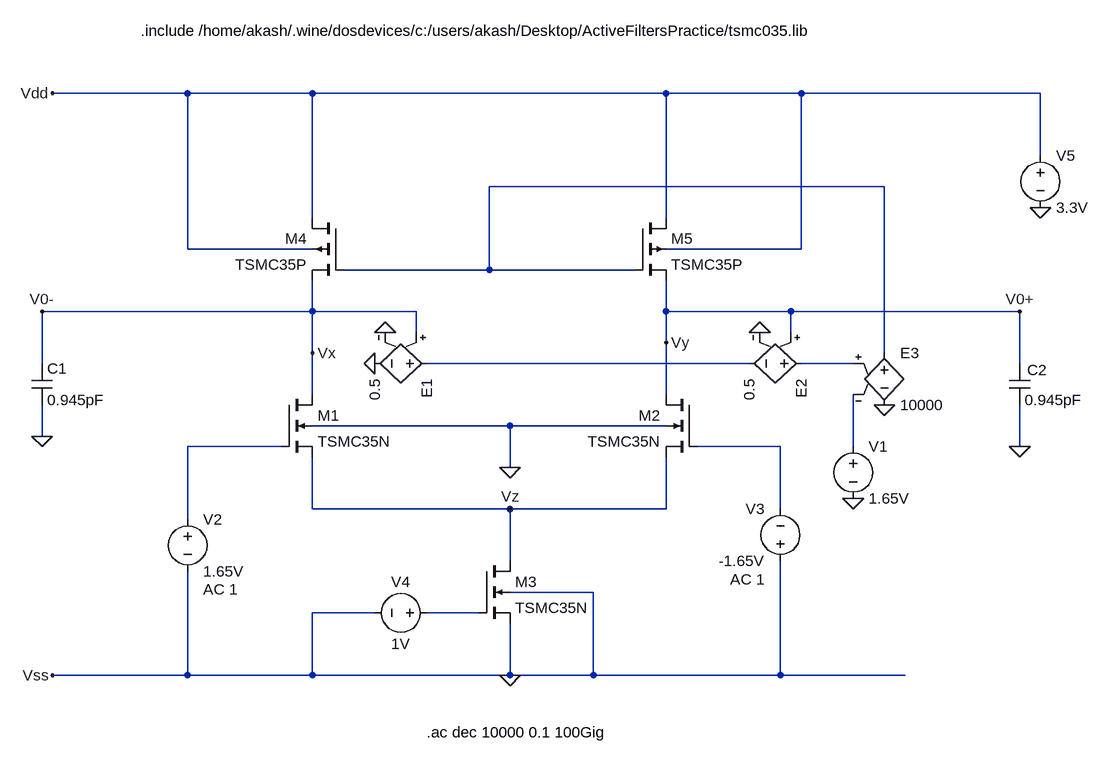
[diagram p0: schematic Transconductor_with_CMFB.asc]
Transconductor_with_CMFB.asc, the LTspice schematic file:
Version 4
SHEET 1 1440 1128
WIRE -16 112 -224 112
WIRE 176 112 -16 112
WIRE 720 112 176 112
WIRE 928 112 720 112
WIRE 1296 112 928 112
WIRE 1296 208 1296 112
WIRE 1056 256 448 256
WIRE 176 304 176 112
WIRE 720 304 720 112
WIRE -16 352 -16 112
WIRE 176 352 -16 352
WIRE 928 352 928 112
WIRE 928 352 720 352
WIRE 448 384 448 256
WIRE 448 384 224 384
WIRE 672 384 448 384
WIRE 176 448 176 400
WIRE 176 448 -240 448
WIRE 336 448 176 448
WIRE 720 448 720 400
WIRE 912 448 720 448
WIRE 1264 448 912 448
WIRE 336 480 336 448
WIRE 912 480 912 448
WIRE 720 496 720 448
WIRE 176 512 176 448
WIRE 1056 512 1056 256
WIRE -240 528 -240 448
WIRE 848 528 352 528
WIRE 1008 528 928 528
WIRE 1264 528 1264 448
WIRE 176 576 176 512
WIRE 720 576 720 496
WIRE 480 624 176 624
WIRE 720 624 480 624
WIRE -240 640 -240 592
WIRE 128 656 -16 656
WIRE 896 656 768 656
WIRE 1008 656 1008 576
WIRE 1264 656 1264 592
WIRE 480 688 480 624
WIRE 176 752 176 672
WIRE 480 752 176 752
WIRE 720 752 720 672
WIRE 720 752 480 752
WIRE 896 752 896 656
WIRE -16 768 -16 656
WIRE 480 832 480 752
WIRE 608 880 480 880
WIRE 272 912 176 912
WIRE 432 912 352 912
WIRE -16 1008 -16 848
WIRE -16 1008 -224 1008
WIRE 176 1008 176 912
WIRE 176 1008 -16 1008
WIRE 480 1008 480 928
WIRE 480 1008 176 1008
WIRE 608 1008 608 880
WIRE 608 1008 480 1008
WIRE 896 1008 896 832
WIRE 896 1008 608 1008
WIRE 1088 1008 896 1008
FLAG 480 1008 0
FLAG 480 688 0
FLAG 288 480 0
FLAG 864 480 0
FLAG 1056 592 0
FLAG 272 528 0
FLAG 1008 736 0
FLAG 1296 288 0
FLAG 176 512 Vx
FLAG 720 496 Vy
FLAG 480 752 Vz
FLAG -224 112 Vdd
FLAG -224 1008 Vss
FLAG -240 640 0
FLAG 1264 656 0
FLAG 1264 448 V0+
FLAG -240 448 V0-
SYMBOL nmos4 128 576 R0
SYMATTR InstName M1
SYMATTR Value TSMC35N
SYMATTR Value2 l=0.5u w=1.77u m=8
SYMBOL nmos4 768 576 M0
SYMATTR InstName M2
SYMATTR Value TSMC35N
SYMATTR Value2 l=0.5u w=1.77u m=8
SYMBOL nmos4 432 832 R0
SYMATTR InstName M3
SYMATTR Value TSMC35N
SYMATTR Value2 l=0.5u w=1.33u m=16
SYMBOL pmos4 224 304 M0
SYMATTR InstName M4
SYMATTR Value TSMC35P
SYMATTR Value2 l=0.5u w=1u m=8
SYMBOL pmos4 672 304 R0
SYMATTR InstName M5
SYMATTR Value TSMC35P
SYMATTR Value2 l=0.5u w=1u m=8
SYMBOL e 368 528 R90
SYMATTR InstName E1
SYMATTR Value 0.5
SYMBOL e 944 528 R90
SYMATTR InstName E2
SYMATTR Value 0.5
SYMBOL e 1056 496 R0
SYMATTR InstName E3
SYMATTR Value 10000
SYMBOL voltage 1008 640 R0
SYMATTR InstName V1
SYMATTR Value 1.65V
SYMBOL voltage -16 752 R0
WINDOW 123 24 124 Left 2
WINDOW 39 0 0 Left 0
SYMATTR InstName V2
SYMATTR Value 1.65V
SYMATTR Value2 AC 1
SYMBOL voltage 896 848 R180
WINDOW 0 24 96 Left 2
WINDOW 3 24 16 Left 2
WINDOW 123 24 -12 Left 2
WINDOW 39 0 0 Left 0
SYMATTR InstName V3
SYMATTR Value -1.65V
SYMATTR Value2 AC 1
SYMBOL voltage 368 912 R90
WINDOW 0 -32 56 VBottom 2
WINDOW 3 32 56 VTop 2
SYMATTR InstName V4
SYMATTR Value 1V
SYMBOL voltage 1296 192 R0
SYMATTR InstName V5
SYMATTR Value 3.3V
SYMBOL cap -256 528 R0
SYMATTR InstName C1
SYMATTR Value 0.945pF
SYMBOL cap 1248 528 R0
WINDOW 0 28 10 Left 2
SYMATTR InstName C2
SYMATTR Value 0.945pF
TEXT -88 16 Left 2 !.include /home/akash/.wine/dosdevices/c:/users/akash/Desktop/ActiveFiltersPractice/tsmc035.lib
TEXT 352 1096 Left 2 !.ac dec 10000 0.1 100Gig

The netlist it stands for:
* Transconductor_with_CMFB.asc
M1 V0- N004 Vz 0 TSMC35N l=0.5u w=1.77u m=8
M2 V0+ N005 Vz 0 TSMC35N l=0.5u w=1.77u m=8
M3 Vz N007 0 0 TSMC35N l=0.5u w=1.33u m=16
M4 Vdd N001 V0- Vdd TSMC35P l=0.5u w=1u m=8
M5 Vdd N001 V0+ Vdd TSMC35P l=0.5u w=1u m=8
E1 N002 0 V0- 0 0.5
E2 N003 N002 V0+ 0 0.5
E3 N001 0 N003 N006 10000
V1 N006 0 1.65V
V2 N004 0 1.65V AC 1
V3 0 N005 -1.65V AC 1
V4 N007 0 1V
V5 Vdd 0 3.3V
C1 V0- 0 0.945pF
C2 V0+ 0 0.945pF
.model NMOS NMOS
.model PMOS PMOS
.lib standard.mos
.include /home/akash/.wine/dosdevices/c:/users/akash/Desktop/ActiveFiltersPractice/tsmc035.lib
.ac dec 10000 0.1 100Gig
.backanno
.end